# EAGLE design hypnagogo (EAGLE 6.1)
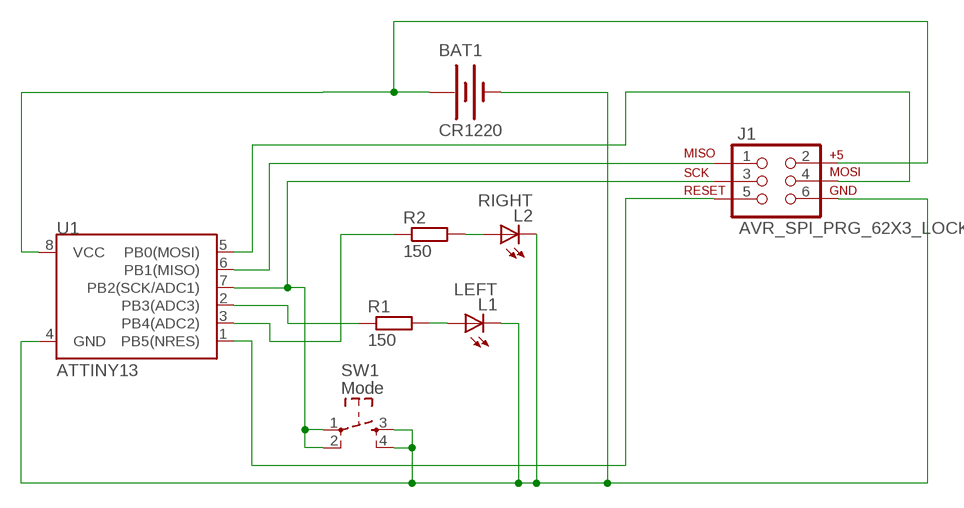
[diagram p0: schematic, sheet 1]

## Parts
BAT1  CR1220  BATTERY12MM  [BATTCON_12MM]
J1  AVR_SPI_PRG_62X3_LOCK  [2X3_LOCK]
L1  LEFT  LED-3MM  [LED-3MM]
L2  RIGHT  LED-3MM  [LED-3MM]
R1  150  RESISTORR805-0805  [R805]
R2  150  RESISTORR805-0805  [R805]
SW1  Mode  SW_TACT  [SW_TACT_SMALL]
U1  ATTINY13  ATTINY13SOIC  [SO08]

## Nets
/RESET: J1.5 U1.1(PB5(NRES))
GND: BAT1.GND(-) J1.6 L1.K(C) L2.K(C) SW1.3 SW1.4 U1.4(GND)
L1-R: L1.A R1.2
L2: R2.1 U1.3(PB4(ADC2))
L2-R: L2.A R2.2
MISO: J1.1 U1.6(PB1(MISO))
MOSI: J1.4 U1.5(PB0(MOSI))
PB2/SCK: J1.3 SW1.1 SW1.2 U1.7(PB2(SCK/ADC1))
PB3: R1.1 U1.2(PB3(ADC3))
VCC: BAT1.PWR@1(+) J1.2 U1.8(VCC)

## Library data of the parts
BAT1 = SparkFun:BATTERY: Battery Holders Various common sizes : AA, AAA, 20mm coin cell and 12mm coin cell.
J1 = SparkFun:AVR_SPI_PRG_6: AVR ISP 6 Pin This is the reduced ISP connector for AVR programming. Common on Arduino. This footprint will take up less PCB space and can be used with a 10-pin to 6-pin adapter such as SKU: BOB-08508
L1 L2 = dp_devices:LED: Light Emitting Diode
R1 R2 = dp_devices:RESISTOR
SW1 = dp_devices:SW_TACT
U1 = SparkFun:ATTINY13

## Board
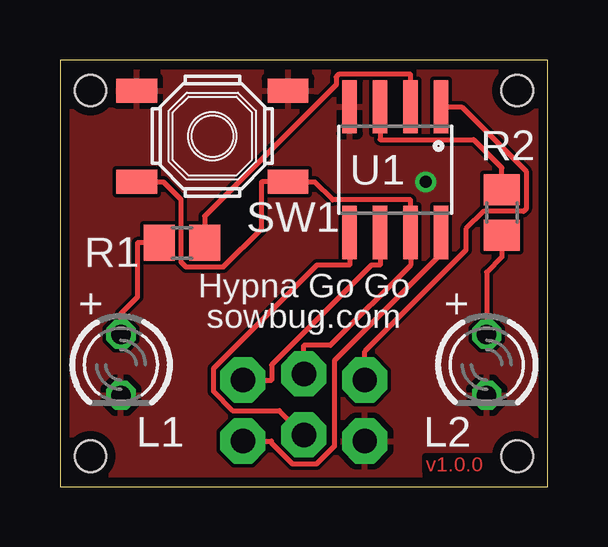
[diagram p1: board, top side]
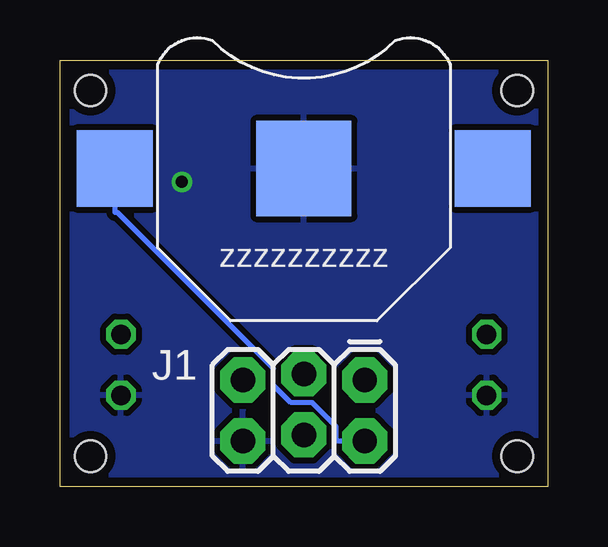
[diagram p2: board, bottom side, seen from below]

Size 20.32 x 17.78 mm. Coordinates in mm from the lower left corner, seen from the top.
Outline: 0,17.78 0,0 20.32,0 20.32,17.78 0,17.78
Copper layers (1*16): Top 0.0356mm / dielectric 1.5011mm / Bottom 0.0356mm
Design rules: minimum track width 8mil, minimum drill 13mil, track to track 6mil, track to pad 6mil, pad to pad 6mil, via to via 6mil, smd to smd 6mil, copper to edge 15mil, drill to drill 6mil, minimum pad ring 7mil, minimum via ring 7mil, stop-mask expansion 4mil, vias tented up to drill 0mil, thermal gap 10mil
Holes 1.3 mm at 1.27,1.27 1.27,16.51 19.05,1.27 19.05,16.51

### Footprints (pad centres in the part's own frame; a part is rotated, then mirrored left to right if it is on the bottom)
BATTCON_12MM = smd 3.962 x 3.962: GND 0,0 | smd 3.175 x 3.175: PWR@1 -7.874,0; PWR@2 7.874,0
2X3_LOCK = drill 1.016 pad 1.88 octagon: 1 0,0; 2 0,2.54; 3 2.54,-0.254; 4 2.54,2.286; 5 5.08,0; 6 5.08,2.54
LED-3MM = drill 0.813 octagon: A -1.27,0; K 1.27,0
R805 = smd 1.3 x 1.5: 1 -0.95,0; 2 0.95,0
SW_TACT_SMALL = smd 1.7 x 1: 1 -3.15,1.9; 2 3.15,1.9; 3 -3.15,-1.9; 4 3.15,-1.9
SO08 = smd 0.61 x 2.21: 1 -1.905,-2.616; 2 -0.635,-2.616; 3 0.635,-2.616; 4 1.905,-2.616; 5 1.905,2.616; 6 0.635,2.616; 7 -0.635,2.616; 8 -1.905,2.616

### Placement (x,y rotation side)
BAT1  10.16,13.26 0 bottom
J1  7.62,4.45 180 bottom
L1  2.54,5.08 270 top
L2  17.78,5.08 270 top
R1  5.08,10.16 180 top
R2  18.41,11.43 270 top
SW1  6.35,14.61 180 top
U1  13.97,13.21 180 top

### Tracks (layer width: path | path; a pad name or v marks a point on that pad's centre or on a via)
/RESET
  Top 0.203: J1.5 12.7,5.64 16.92,9.86 16.92,10.74 17.65,11.48 19.32,11.48 19.42,11.58 19.42,13.13 16.73,15.82 U1.1
GND  (via drill 0.5)
  Top 0.203: 9.65,16.51 SW1.3
  other vias: 15.24,12.7
  pour Bottom (isolate 0.254): 21.59,19.05 21.59,-1.27 -1.27,-1.27 -1.27,19.05
  pour Top: 21.59,19.05 21.59,-1.27 -1.27,-1.27 -1.27,19.05
L1-R
  Top 0.203: L1.A 2.54,7.21 3.23,7.9 3.23,10.16 R1.2
L2
  Top 0.203: R2.1 18.41,13.28 17.23,14.46 13.34,14.46 U1.3
L2-R
  Top 0.203: R2.2 18.41,9.58 17.78,8.94 L2.A
MISO
  Top 0.203: J1.1 8.81,4.45 8.81,5.07 12.97,9.23 13.34,9.23 U1.6
MOSI
  Top 0.203: U1.5 12.06,9.23 10.71,9.23 6.39,4.92 6.39,3.97 7.18,3.17 9.14,3.17 J1.4
PB2/SCK
  Top 0.203: SW1.2 4.3,12.71 5.03,11.97 5.03,9.37 5.25,9.16 6.81,9.16 8.4,10.74 8.4,12.71 SW1.1 10.6,12.71 11.36,11.95 14.61,11.95 U1.7 14.61,9.91 14.61,9.23 11.27,5.89 10.16,5.89 J1.3
PB3
  Top 0.203: U1.2 14.61,17.18 11.61,17.18 11.51,17.08 11.51,16.75 6.03,11.27 R1.1
VCC
  Top 0.203: J1.2 8.81,1.91 8.81,1.81 9.69,0.94 10.68,0.94 11.43,1.69 11.43,5.26 15.88,9.7 U1.8
  Bottom 0.203: BAT1.PWR@1 18.03,11.42 17.92,11.42 11.43,4.93 11.43,4.23 10.7,3.5 9.82,3.5 8.81,2.5 8.81,1.91 J1.2

### Text on the board
Top: v1.0.0
tPlace: + | +
tNames: Hypna Go Go | sowbug.com
bNames: zzzzzzzzzz